# Altium schematic sheet esp32-s3-mini-1.SchDoc
size B; SheetNumber: 2; SheetTotal: 5
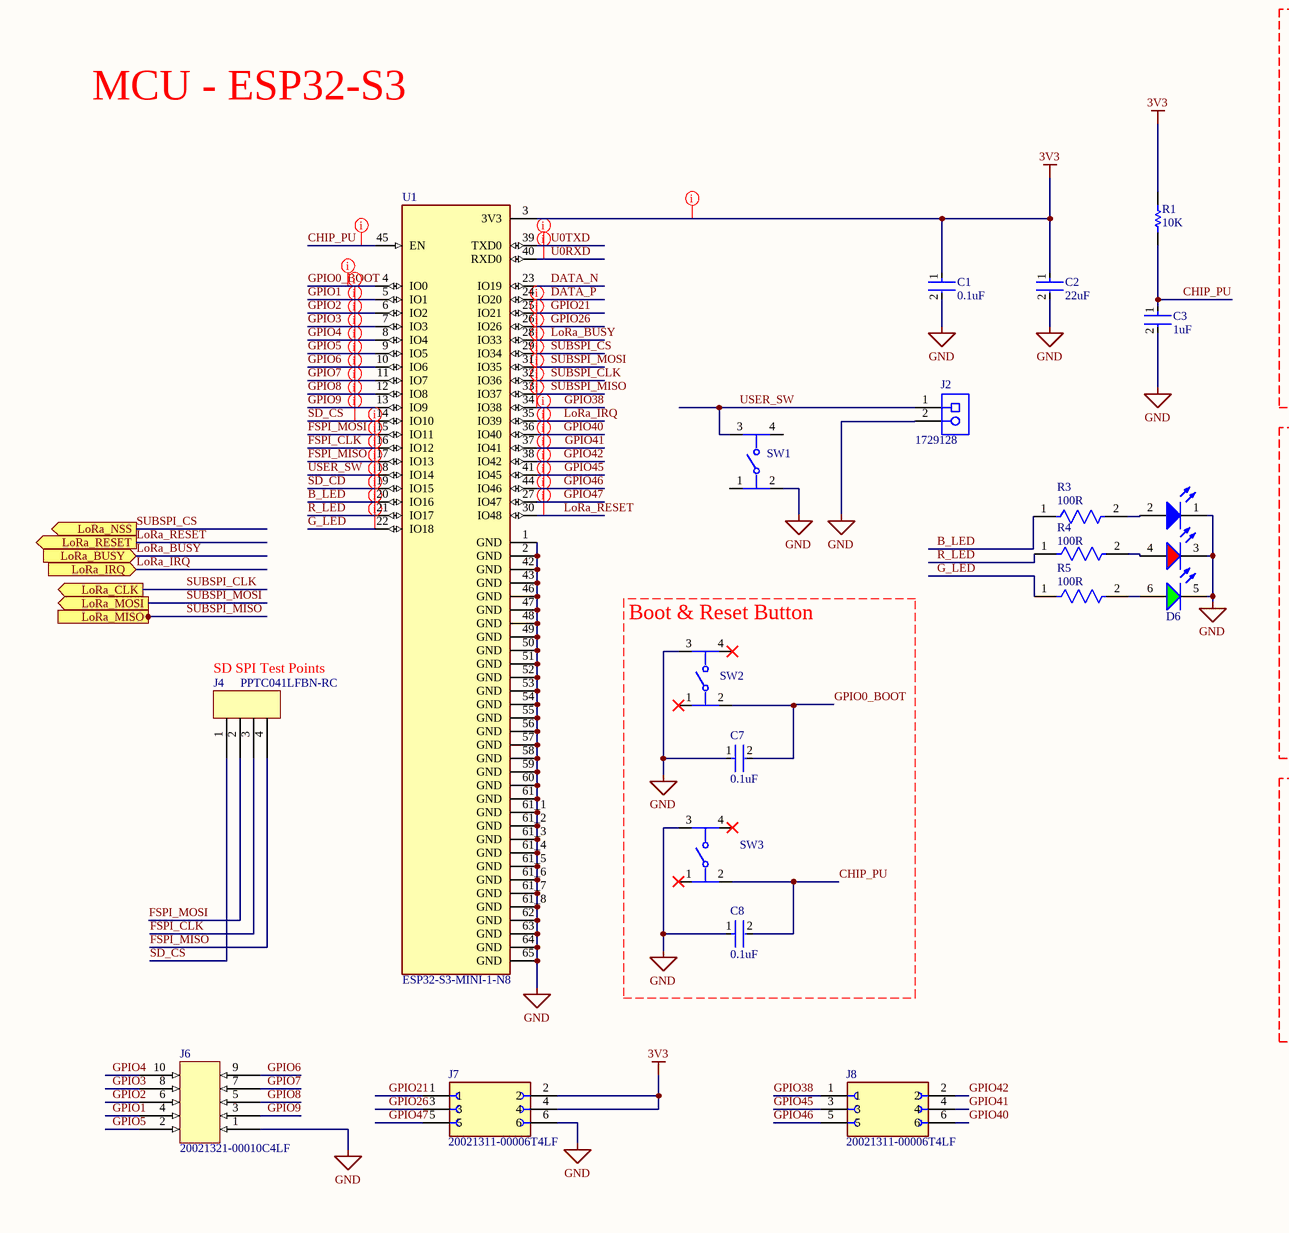
[diagram p0: esp32-s3-mini-1.SchDoc, left]
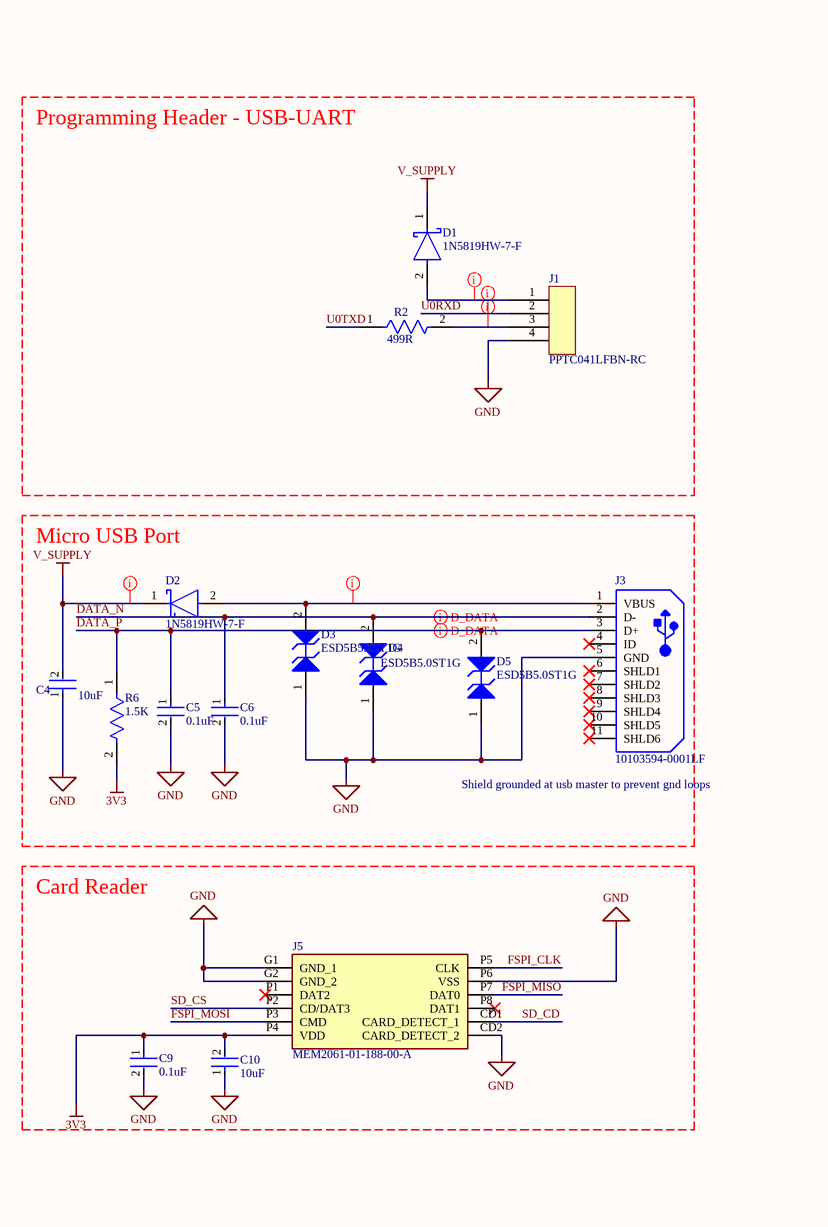
[diagram p1: esp32-s3-mini-1.SchDoc, right]

## Parts
?  (no value)  (graphical)
C1  0.1uF  [FP-GCM21B-0_15-MFG]
C2  22uF  [FP-GRM21B-0_15-MFG]
C3  1uF  [FP-GCJ219-0_3-IPC_A]
C4  10uF  [FP-GRM21B-0_15-IPC_C]
C5  0.1uF  [FP-GCM21B-0_15-MFG]
C6  0.1uF  [FP-GCM21B-0_15-MFG]
C7  0.1uF  [FP-GCM21B-0_15-MFG]
C8  0.1uF  [FP-GCM21B-0_15-MFG]
C9  0.1uF  [FP-GCM21B-0_15-MFG]
C10  10uF  [FP-GRM21B-0_15-IPC_C]
D1  1N5819HW-7-F  [FP-SOD123-IPC_A]
D2  1N5819HW-7-F  [FP-SOD123-IPC_A]
D3  ESD5B5.0ST1G  [ONSC-SOD-523-2-502-01_C_V]
D4  ESD5B5.0ST1G  [ONSC-SOD-523-2-502-01_C_V]
D5  ESD5B5.0ST1G  [ONSC-SOD-523-2-502-01_C_V]
D6  Red & Green & Blue, 120°  [WL-SFTW_5050_150505M173300]  (value not drawn)
J1  PPTC041LFBN-RC  [SIP4-100mil]
J2  1729128  [PHOE-1729128-2_V]
J3  10103594-0001LF  [MICRO_USB2.0]
J4  PPTC041LFBN-RC  [SIP4-100mil]
J5  MEM2061-01-188-00-A  [MEM20610118800A]
J6  20021321-00010C4LF  [FP-20021321-00010C4LF-MFG]
J7  20021311-00006T4LF  [AMPHENOL_20021311-00006T4LF]
J8  20021311-00006T4LF  [AMPHENOL_20021311-00006T4LF]
R1  10K  [RESC2013X70X40ML20T20]
R2  499R  [FP-ERJ6EN-IPC_B]
R3  100R  [FP-RNCP0805-MFG]
R4  100R  [FP-RNCP0805-MFG]
R5  100R  [FP-RNCP0805-MFG]
R6  1.5K  [FP-ERJ6EN-MFG]
SW1  PTS526SK15SMTR2LFS  [FP-PTS526SK15SMTR2LFS-MFG]  (value not drawn)
SW2  PTS526SK15SMTR2LFS  [FP-PTS526SK15SMTR2LFS-MFG]  (value not drawn)
SW3  PTS526SK15SMTR2LFS  [FP-PTS526SK15SMTR2LFS-MFG]  (value not drawn)
U1  ESP32-S3-MINI-1-N8  [XCVR_ESP32-S3-MINI-1-N8]

## Blocks framed on the sheet
Programming Header - USB-UART: D1 J1 R2
Micro USB Port: C4-C6 D2-D5 J3 R6
Boot & Reset Button: C7 C8 SW2 SW3
Card Reader: C9 C10 J5

## Ports
LoRa_BUSY (in), LoRa_CLK (out), LoRa_IRQ (in), LoRa_MISO (in), LoRa_MOSI (out), LoRa_NSS (out), LoRa_RESET (out)

## Nets
3V3: C1.1 C2.1 C9.1 C10.2 J5.P4(VDD) J7.2 J7.4 R1.2 R6.2 U1.3(3V3)
GND: C1.2 C2.2 C3.2 C4.1 C5.2 C6.2 C7.1 C8.1 C9.2 C10.1 D3.1(A1) D4.1(A1) D5.1(A1) D6.1(K) D6.3(K) D6.5(K) J1.4 J2.2 J3.5(GND) J5.CD2(CARD_DETECT_2) J5.G1(GND_1) J5.G2(GND_2) J5.P6(VSS) J6.1 J7.6 SW1.2 SW2.3 SW3.3 U1.1(GND) U1.2(GND) U1.42(GND) U1.43(GND) U1.46(GND) U1.47(GND) U1.48(GND) U1.49(GND) U1.50(GND) U1.51(GND) U1.52(GND) U1.53(GND) U1.54(GND) U1.55(GND) U1.56(GND) U1.57(GND) U1.58(GND) U1.59(GND) U1.60(GND) U1.61(GND) U1.61_1(GND) U1.61_2(GND) U1.61_3(GND) U1.61_4(GND) U1.61_5(GND) U1.61_6(GND) U1.61_7(GND) U1.61_8(GND) U1.62(GND) U1.63(GND) U1.64(GND) U1.65(GND)
V_SUPPLY: C4.2 D1.1(C) D2.1(C)
B_LED: R3.1 U1.20(IO16)
CHIP_PU: C3.1 C8.2 R1.1 SW3.2 U1.45(EN)
DATA_N: C6.1 D4.2(A2) J3.2(D-) U1.23(IO19)
DATA_P: C5.1 D5.2(A2) J3.3(D+) R6.1 U1.24(IO20)
FSPI_CLK: J4.3 J5.P5(CLK) U1.16(IO12)
FSPI_MISO: J4.4 J5.P7(DAT0) U1.17(IO13)
FSPI_MOSI: J4.2 J5.P3(CMD) U1.15(IO11)
G_LED: R5.1 U1.22(IO18)
GPIO0_BOOT: C7.2 SW2.2 U1.4(IO0)
GPIO1: J6.4 U1.5(IO1)
GPIO2: J6.6 U1.6(IO2)
GPIO3: J6.8 U1.7(IO3)
GPIO4: J6.10 U1.8(IO4)
GPIO5: J6.2 U1.9(IO5)
GPIO6: J6.9 U1.10(IO6)
GPIO7: J6.7 U1.11(IO7)
GPIO8: J6.5 U1.12(IO8)
GPIO9: J6.3 U1.13(IO9)
GPIO21: J7.1 U1.25(IO21)
GPIO26: J7.3 U1.26(IO26)
GPIO38: J8.1 U1.34(IO38)
GPIO40: J8.6 U1.36(IO40)
GPIO41: J8.4 U1.37(IO41)
GPIO42: J8.2 U1.38(IO42)
GPIO45: J8.3 U1.41(IO45)
GPIO46: J8.5 U1.44(IO46)
GPIO47: J7.5 U1.27(IO47)
LoRa_BUSY: U1.28(IO33) ; port LoRa_BUSY
LoRa_IRQ: U1.35(IO39) ; port LoRa_IRQ
LoRa_RESET: U1.30(IO48) ; port LoRa_RESET
R_LED: R4.1 U1.21(IO17)
SD_CD: J5.CD1(CARD_DETECT_1) U1.19(IO15)
SD_CS: J4.1 J5.P2(CD/DAT3) U1.14(IO10)
SUBSPI_CLK: U1.32(IO36) ; port LoRa_CLK
SUBSPI_CS: U1.29(IO34) ; port LoRa_NSS
SUBSPI_MISO: U1.33(IO37) ; port LoRa_MISO
SUBSPI_MOSI: U1.31(IO35) ; port LoRa_MOSI
U0RXD: J1.2 U1.40(RXD0)
U0TXD: R2.1 U1.39(TXD0)
USER_SW: J2.1 SW1.3 U1.18(IO14)
NetD1_2: D1.2(A) J1.1
NetD2_2: D2.2(A) D3.2(A2) J3.1(VBUS)
NetD6_2: D6.2(A) R3.2
NetD6_4: D6.4(A) R4.2
NetD6_6: D6.6(A) R5.2
NetJ1_3: J1.3 R2.2

Not connected (* = marked no-connect by the designer): J3 4(ID)* 6(SHLD1)* 7(SHLD2)* 8(SHLD3)* 9(SHLD4)* 10(SHLD5)* 11(SHLD6)*; J5 P1(DAT2)* P8(DAT1)*; SW1 1 4; SW2 1* 4*; SW3 1* 4*

## Layout directives
differential pair: DATA_N, DATA_P
net class PWR_SUPPLY: NetD1_2, NetD2_2, V_SUPPLY
net class PWR_REG: 3V3
net class DIGITAL: B_LED, CHIP_PU, FSPI_MOSI, G_LED, GPIO0_BOOT, GPIO1, GPIO2, GPIO3, GPIO4, GPIO5, GPIO6, GPIO7, GPIO8, GPIO9, GPIO21, GPIO26, GPIO38, GPIO40, GPIO41, GPIO42, GPIO45, GPIO46, GPIO47, LoRa_BUSY, LoRa_IRQ, LoRa_RESET, NetJ1_3, R_LED, SD_CD, U0RXD, U0TXD, USER_SW
net class SPI: FSPI_CLK, FSPI_MISO, SD_CS, SUBSPI_CLK, SUBSPI_CS, SUBSPI_MISO, SUBSPI_MOSI

## Notes on the sheet
- MCU - ESP32-S3
- SD SPI Test Points
- (near J3) Shield grounded at usb master to prevent gnd loops
- Copyright © NRG measurement
- Page Contents:
- Project:
- Variant:
- Checked by:
- Date:
- Size:
- B
- DWG NO:
- Sheet
- of
- Revision:

## Library data of the parts
? = CMP-001-0000-4: Title block sheet B
C1 C5-C9 = CMP-2007-03364-2: Ceramic Capacitor for Automotive 100nF ±10% 100VDC X7R 0805 Embossed T/R; Voltage Rating: 100V; Termination: SMD/SMT; Tolerance: 10%; Case Code (Imperial): 0805; Length: 2mm; Max Operating Temperature: 125°C; Case/Package: 0805; Mount: Surface Mount; Packaging: Tape and Reel; Package Quantity: 1; Min Operating Temperature: -55°C; Case Code (Metric): 2012; Radiation Hardening: No; REACH SVHC: No SVHC; Dielectric: X7R; Depth: 1.25mm; Lead Free: Lead Free; Ratings: AEC-Q200; Height: 1.25mm; Voltage: 100V; Capacitance: 100nF; Voltage Rating (DC): 100V; Width: 0.049inch; Thickness: 0.055inch
C2 = CMP-2007-03385-2: Chip Multilayer Ceramic Capacitors for General Purpose, 0805, 22uF, X5R, 15%, 20%, 6.3V; Material: Ceramic; Max Operating Temperature: 85°C; Voltage: 6.3V; Min Operating Temperature: -55°C; Case/Package: 0805; Thickness: 0.053inch; Dielectric: X5R; Packaging: Tape and Reel; Depth: 1.25mm; Termination: SMD/SMT; Voltage Rating (DC): 6.3V; Radiation Hardening: No; Tolerance: 20%; Mount: Surface Mount; Lead Free: Lead Free; Package Quantity: 1; REACH SVHC: No SVHC; Voltage Rating: 6.3V; Capacitance: 22uF; Length: 2mm; Case Code (Imperial): 0805; Case Code (Metric): 2012; Width: 0.049inch; Height: 1.25mm
C3 = CMP-2007-00069-2: Cap Ceramic Multilayer 1uF 16VDC 10% SMD Paper T/R; Dielectric: X7R; Voltage Rating (DC): 16V; Case Code (Imperial): 0805; Termination: SMD/SMT; Ratings: AEC-Q200; Capacitance: 1uF; Package Quantity: 1; Radiation Hardening: No; Mount: Surface Mount; Packaging: Tape and Reel; Max Operating Temperature: 125°C; Voltage Rating: 16V; Width: 1.25mm; Tolerance: 10%; Features: Soft Termination; Height: 0.85mm; Case Code (Metric): 2012; Min Operating Temperature: -55°C; Length: 2mm; Lead Free: Lead Free; Thickness: 0.037inch; Depth: 1.25mm; Case/Package: 0805
C4 C10 = CMP-2007-03541-2: Chip Multilayer Ceramic Capacitors for General Purpose, 0805, 10uF, X5R, 15%, 10%, 25V; Length: 2mm; Depth: 1.25mm; Termination: SMD/SMT; Voltage: 25V; Height: 1.25mm; Material: Ceramic; Thickness: 0.053inch; Radiation Hardening: No; Min Operating Temperature: -55°C; Width: 0.049inch; Package Quantity: 1; Mount: Surface Mount; Dielectric: X5R; Packaging: Tape and Reel; Capacitance: 10uF; Voltage Rating (DC): 25V; Lead Free: Lead Free; Max Operating Temperature: 85°C; Case Code (Imperial): 0805; Case/Package: 0805; Tolerance: 10%; Voltage Rating: 25V; Case Code (Metric): 2012
D1 D2 = CMP-0303-00003-3: DIODE SCHOTTKY 40V 1A SOD123; Forward Voltage: 450mV; Capacitance: 110pF; Max Forward Surge Current (Ifsm): 25A; Peak Reverse Current: 50uA; Polarity: Standard; Element Configuration: Single; Max Power Dissipation: 450mW; Min Operating Temperature: -65°C; Package Quantity: 3000; Contact Plating: Tin; Weight: 0.000353oz; Max Repetitive Reverse Voltage (Vrrm): 40V; Max Reverse Voltage (DC): 40V; Height: 1.25mm; Average Rectified Current: 1A; Width: 1.7mm; Case/Package: SOD-123-2; Lead Free: Lead Free; Max Operating Temperature: 125°C; Current Rating: 1A; Termination: SMD/SMT; Forward Current: 1A; Radiation Hardening: No; Number of Pins: 2; Length: 2.85mm; Voltage Rating (DC): 40V; REACH SVHC: No SVHC; Peak Non-Repetitive Surge Current: 25A; Packaging: Tape and Reel; Output Current: 1A
D3-D5 = CMP-1063-00096-1: Transient Voltage Suppressor, Micro-Packaged Diode for ESD Protection, 2-Pin SOD-523, Pb-Free, Tape and Reel; Manufacturer: On Semiconductor; Number of Lines: 1; Direction: Bidirectional; VRWM Max (V): 5; V(BR) Min (V): 5.8; ComponentLink2URL: http://www.onsemi.cn/pub_link/Collateral/ESD5B5.0ST1G.PDF; Mounting Technology: Surface Mount; ComponentLink1URL: http://www.onsemi.com/; ComponentLink2Description: Datasheet; ComponentLink3Description: Package Specification; RoHS: Pb-Free; Packing: Tape and Reel; PackageDescription: 2-Pin SOD, Body 1.2 x 0.8 mm; ComponentLink1Description: Manufacturer URL; ComponentLink3URL: http://www.onsemi.cn/pub_link/Collateral/ESD5B5.0ST1G.PDF; PackageVersion: Rev. C, 03/2007; DatasheetVersion: Rev. 3; PartNumber: ESD5B5.0ST1G; PackageReference: SOD-523-2-502-01_C; IR Max (uA): 1
D6 = 150505M173300: WL-SFTW Full-color TOP LED Waterclear, size 5050, Red & Green & Blue, 120°; Manufacturer: Wurth Elektronik; Case/Size Code: 5050; Chip Technology: AlInGaP + InGaN; Dominant Wavelength (Blue): 470nm; Dominant Wavelength (Green): 520nm; Dominant Wavelength (Red): 625nm; Forward Voltage (Blue): 3.2V; Forward Voltage (Red): 2V; Luminous Intensity (Blue): 350mcd; Luminous Intensity (Green): 1300mcd; Luminous Intensity (Red): 800mcd; Peak Wavelength (Blue): 465nm; Peak Wavelength (Green): 515nm; Peak Wavelength (Red): 635nm; Manufacturer Part Number: 150505M173300; Category: Signal LEDs; Match Code: WL-SFTW; ComponentLink1Description: Website Link; ComponentLink1URL: https://www.we-online.com/redexpert/article/150505M173300?ad; ComponentLink2Description: Datasheet Link; ComponentLink2URL: https://www.we-online.com/redexpert/spec/150505M173300?ad; Mount: Surface Mount; Operating Temperature Max: 85°C; Operating Temperature Min: -40°C; Packaging: Tape and Reel; Length: 5.4mm; Width: 5mm; Height: 1.5mm; Emitting Color: Red & Green & Blue; Forward Voltage (Green): 3.2V; Viewing Angle: 120°
J1 J4 = 4POS_FEMALECONN_2.54mm: Board Connector, 4 Contact(s), 1 Row(s), Female, Straight, 0.1 inch Pitch, Solder Terminal, Locking; Manufacturer: Sullins; Connector Type: BOARD CONNECTOR; Mounting Technology: Board; RoHS Compliant: Yes; Manufacturer Part Number: PPTC041LFBN-RC; Component Type: Connectors; Supplier 1: Digikey; Supplier Part Number 1: S7002-ND
J2 = CMP-2000-05815-1: PCB Terminal Block, 13.5 A, 400 V, 2-Pin THD, RoHS, Bulk; Manufacturer: Phoenix Contact; Package Version: 03/2015; No. of Rows: 1; Pitch: 5.08mm; No. of Positions: 2; Voltage Rating: 400V; Current Rating: 13500mA; Manufacturer URL: http://www.phoenixcontact.com/; Datasheet URL: https://datasheet.ciiva.com/16046/1729128-16046181.pdf; RoHS: TRUE; Package URL: https://www.phoenixcontact.com/online/portal/pi/pxc/product_detail_page/!ut/p/b1/3VdJjqNKFDxLH8AFycySyWY2ozFsEPOMMQaDOX1XedGL_1Vdm5YXJleknhSKeBkvI6EA8ncAo3AYoDhBQGco6KN7VURTdemj9us_IEKEZo_YHiPAEWEFmDGOHMORkqKYCORBZxgL7ZoaZYcbFFUZ3fqxSY6GOuxydWUuHqz1ynmMFygu583Bob0Ewr6Sd_l-5m-kAueHiB0jpRwZwe58wwtkpxtMYd_LmGcDRU02dRNEyWt6Y2ti5pSyJ_reIkzIulrqApdnbT11V5jnCKbYNCvhEM1MCpPByat_X379-iThf08CI5GfOPqfBeS3BRoBOdD55AKVv0iLwCMq-2BrzXWSGRH7pUGD9uwXQjiph3xL0DKQwdGa0JImiIOmBNOestqgwTHSSs2oOep-78apyXQBvNi8ZLaFjvjWvcaUEBu0MC6Wbe-d6mB0FAebo2lUWinqYaZs5DAYzV0RP9yitUjnGJ0iI9xhZkT42OCQNUJJhkgWINNQLP2JFP6OpMg3JCVg70jqHT0lvKOnhHf0lPuOnnLf0VPuWx6_dxwUIvwk5WMkT0kLL1mh61l2yZVSzG3pYV_bqo-mj6uMKwKwdnnW8Jh5RTOJzMOA5c-eJDaZQw4mTMPH02PvS_ZAqNVjVTo2WyYLkwH_KU1mmmG5kjRhDqPXLwwVHvVOjCM60-fpXvTDfMGW1PVFVS1r4e4yVDk4ZdNbkUHvqPqQSeian4UD39fNKmachqdJ1NJbyk8rXT9mXTvPk3oE5meulKGgiruPJek-4I9hTT6G8ZLOyRSm2RRVbThERQad5OS28hdt4YW4vG0stgYYzsWsK4_7y6DZMjJSCqri1kyiZR5vD7pwIrNR7QwPHTcLTI5qT7eRlpHrdGiupYlqQDJ7zy_CND8fWWBoLRXxk1RVcXiBQwbTD4Xi7KL-FuO94t9xaqweXzH; PartNumber: 1729128; Package Description: 2-Pin Through Hole Device, Body 8.1 x 10.16 mm, Pitch 5.08 mm; Datasheet Version: 12/2013; Mounting Technology: ThroughHole; Orientation: Horizontal; Package Reference: 1729128-2; Packing: Bulk
J3 = MICRO_USB2.0: Micro USB 2.0 B Receptacle, 5 Position, Height 3.24 mm, -55 to 85 degC, RoHS, Tape and Reel; Manufacturer: Amphenol ICC / FCI; Gender: Female; Voltage Rating: 100V; Current Rating: 1.8A; Package Reference: FCI-10103594-0001LF; RoHS Compliant: True; Mounting Technology: SM; Max Operating Temperature: 85°C; Contact Plating: Gold; Manufacturer URL: http://portal.fciconnect.com/; Datasheet URL: http://portal.fciconnect.com/Comergent//fci/drawing/10103594.pdf; Package Description: 5-Pin Surface Mount Device, Body 8.04 x 5.62 mm; Contact Material: Copper; Packaging: TapeandReel; Connector Type: USB; Package Quantity: 1500; Pins: 5; Case/Package: FCI-10103594-0001LF; Min Operating Temperature: -55°C; Lead Pitch: 0.65mm; Datasheet Version: Rev. A, 06/2010; Manufacturer Part Number: 10103594-0001LF; Component Type: Connectors
J5 = CMP-002-00108-2: MEM2061 Series 8 Position 1.1 mm Pitch Push-Push MicroSD SMT Memory Card Connector; Manufacturer_Name: GCT (GLOBAL CONNECTOR TECHNOLOGY); Geometry.Height: 2.13mm; Source: MEM2061-01-188-00-A.SchLib; Design Item ID: MEM2061-01-188-00-A; Mouser Part Number: 640-MEM20610118800A; Datasheet Link: https://gct.co/files/drawings/mem2061.pdf?v=db251ddb-1946-4f24-aa19-b8a17901bdd2; Manufacturer_Part_Number: MEM2061-01-188-00-A; Mouser Price/Stock: https://www.mouser.co.uk/ProductDetail/GCT/MEM2061-01-188-00-A?qs=KUoIvG%2F9IlYc25USp0M1eQ%3D%3D
J6 = CMP-002-00151-1: PCB Receptacle, Vertical, Board-to-Board, 1.27 mm, 2 Rows, 10 Contacts, Surface Mount
J7 J8 = AMPHENOL_2x3_FEMALE_1.27: Amphenol Female board to board connector, 2x3 1.27mm pitch, TH mounted; Manufacturer: Amphenol ICC / FCI; MF: {'manufacturer': u'Amphenol ICC (FCI)'}; Pins: 6; Value: *; Design Item ID: 20021311-00006T4LF; MP: 20021311-00006T4LF; Component Type: Connectors; Price: None; Source: 20021311-00006T4LF.SchLib; Availability: Unavailable; Case/Package: None; Supplier: Avnet; Supplier Part Number: 82R8642; Manufacturer Part Number: 20021311-00006T4LF; RoHS: No; Category: Connectors; Stock: 857; ComponentLink1URL: https://media.digikey.com/pdf/Data%20Sheets/FCI%20PDFs/Minitek%20127_Catalog.pdf?src-supplier=Digikey; ComponentLink1Description: https://media.digikey.com/pdf/Data%20Sheets/FCI%20PDFs/Minitek%20127_Catalog.pdf?src-supplier=Digikey; ComponentLink2URL: http://portal.fciconnect.com/Comergent/fci/drawing/20021311.pdf?src-supplier=Avnet; ComponentLink2Description: http://portal.fciconnect.com/Comergent/fci/drawing/20021311.pdf?src-supplier=Avnet; ComponentLink3URL: https://www.distrelec.biz/Web/Downloads/_1/27/fci flyer minitek 127.pdf?mime=application%2Fpdf&src-supplier=Distrelec; ComponentLink3Description: https://www.distrelec.biz/Web/Downloads/_1/27/fci flyer minitek 127.pdf?mime=application%2Fpdf&src-supplier=Distrelec; ComponentLink4URL: https://datasheet.octopart.com/20021311-00006T4LF-Amphenol-Communications-Solutions-datasheet-98396828.pdf?src-supplier=Element14; ComponentLink4Description: https://datasheet.octopart.com/20021311-00006T4LF-Amphenol-Communications-Solutions-datasheet-98396828.pdf?src-supplier=Element14; ComponentLink5URL: http://portal.fciconnect.com/Comergent//fci/drawing/20021311.pdf?src-supplier=Mouser; ComponentLink5Description: http://portal.fciconnect.com/Comergent//fci/drawing/20021311.pdf?src-supplier=Mouser; ComponentLink6URL: http://components.arrow.com/part/dataview/48961538S8522633N8314?src-supplier=Arrow+Electronics; ComponentLink6Description: http://components.arrow.com/part/dataview/48961538S8522633N8314?src-supplier=Arrow+Electronics; ComponentLink7URL: https://datasheet.octopart.com/20021311-00006T4LF-Amphenol-Communications-Solutions-datasheet-62305864.pdf?src-supplier=Electro+Sonic; ComponentLink7Description: https://datasheet.octopart.com/20021311-00006T4LF-Amphenol-Communications-Solutions-datasheet-62305864.pdf?src-supplier=Electro+Sonic; Supplier 1: Digikey; Supplier Part Number 1: 609-3752-ND
R1 = CMP-2001-04376-1: Manufacturer: Panasonic; Part Number: ERJ-6ENF1002V
R2 = CMP-2001-00211-2: RES SMD 499 OHM 1% 1/8W 0805; Temperature Coefficient: 100ppm/°C; Working Voltage: 150V; Power Rating: 125mW; Case/Package: 0805; Mount: Surface Mount; Height: 0.6mm; Resistor Type: Thick Film; Length: 2mm; Depth: 1.25mm; Tolerance: 1%; REACH SVHC: No SVHC; RoHS Compliant: Yes; Case Code (Imperial): 0805; Min Operating Temperature: -55°C; Contact Plating: Tin; Lead Free: Lead Free; Construction: Rectangular; Technology: THICK FILM; Termination: SMD/SMT; Features: Automotive AEC-Q200; Case Code (Metric): 2012; Resistance Tolerance: 1%; Voltage Rating: 150V; Max Operating Temperature: 155°C; Series: ERJ; Packaging: Tape and Reel; Radiation Hardening: No; Military Standard: Not; Voltage Rating (DC): 150V; Package Quantity: 1; Max Power Dissipation: 125mW; Number of Terminations: 2; Resistance: 499R; Width: 0.049inch
R3-R5 = CMP-26527-000164-1: 100Ω ±1% 0.25W 0805 High Power Anti-Sulfur Thin Film Chip Resistor; Max Power Dissipation: 250mW; Temperature Coefficient: 100ppm/°C; Length: 0.079inch; Tolerance: 1%; Min Operating Temperature: -55°C; Resistance: 100R; Mount: Surface Mount; Case Code (Imperial): 0805; Packaging: Tape and Reel; Case/Package: 0805; Height: 0.024inch; Series: RNCP; Width: 0.049inch; Lead Free: Lead Free; Case Code (Metric): 2012; Features: Moisture Resistant; Number of Terminations: 2; Resistor Type: Thin Film; Max Operating Temperature: 155°C; RoHS Compliant: Yes
R6 = CMP-2001-04438-5: RES SMD 1.5K OHM 1% 1/8W 0805; Power Rating: 125mW; Temperature Coefficient: 100ppm/°C; Resistance: 1.5kR; Voltage Rating: 150V; Max Operating Temperature: 155°C; Number of Terminations: 2; Resistance Tolerance: 1%; Size Code: 0805; Case/Package: 0805; Features: Automotive AEC-Q200; Reach SVHC Compliant: Yes; RoHS Compliant: Yes; Mount: Surface Mount; Military Standard: Not; Depth: 1.25mm; Number of Pins: 2; Height: 0.6mm; Case Code (Metric): 2012; Technology: THICK FILM; Radiation Hardening: No; Max Power Dissipation: 125mW; Min Operating Temperature: -55°C; Case Code (Imperial): 0805; Construction: Rectangular; Lead Free: Lead Free; Series: ERJ; Width: 1.2mm; Termination: SMD/SMT; Contact Plating: Tin; Package Quantity: 1; Voltage Rating (DC): 150V; Tolerance: 1%; Length: 2mm; Packaging: Tape and Reel; Resistor Type: Thick Film
SW1-SW3 = CMP-10040-000013-1: TACT 5.2 X 5.2, 1.5 MM H, 260GF,; Manufacturer: C&K; Operating Force: 250gf; Throw Configuration: SPST-NO; Contact Current Rating: 50mA; Standoff Height: 0mm; Contact Resistance: 100mΩ; Voltage Rating Dc: 12V; Electromechanical Life: 200000Cycles; Device Class L3: Tactile Switches; Device Class L2: Switches; Temperature: -20°C to +70°C; Temperature Range Low: -20°C; Package: PTS526SK15SMTR2LFS; Temperature Range High: +70°C; ComponentLink2Description: Datasheet; Device Class L1: Electromechanical; Height: 1.65mm; Digikey Description: TACT 5.2 X 5.2, 1.5 MM H, 260GF,; Category: Switch; RoHS: TRUE; Automotive: No; Lead Free: Yes; Manufacturer Part Number: PTS526SK15SMTR2LFS; Octopart: https://octopart.com/pts526+sk15+smtr2+lfs-c%26k+components-100617999; ComponentLink2URL: https://www.ckswitches.com/media/2780/pts526.pdf
U1 = ESP32-S3-MINI-1-N8: SMD module, ESP32-S3FN8, 8 MB SPI flash, PCB antenna; MF: Espressif Systems; Package: None; Price: None; Check_prices: https://www.snapeda.com/parts/ESP32-S3-MINI-1-N8/Espressif+Systems/view-part/?ref=eda; Value: *; SnapEDA_Link: https://www.snapeda.com/parts/ESP32-S3-MINI-1-N8/Espressif+Systems/view-part/?ref=snap; MP: ESP32-S3-MINI-1-N8; Availability: In Stock; Purchase-URL: https://pricing.snapeda.com/search?q=ESP32-S3-MINI-1-N8&ref=eda; Supplier: Mouser; Supplier Part Number: 356-ESP32-S3-MINI1N8; Manufacturer: Espressif Systems; Manufacturer Part Number: ESP32-S3-MINI-1-N8; RoHS: No; Category: LDO; Stock: 3688; ComponentLink1URL: https://datasheet.octopart.com/ESP32-S3-MINI-1-N8-Espressif-Systems-datasheet-165560562.pdf?src-supplier=TME; ComponentLink1Description: https://datasheet.octopart.com/ESP32-S3-MINI-1-N8-Espressif-Systems-datasheet-165560562.pdf?src-supplier=TME; Supplier 1: Mouser; Supplier Part Number 1: 356-ESP32-S3-MINI1N8